# EAGLE design bms (EAGLE 5.06)
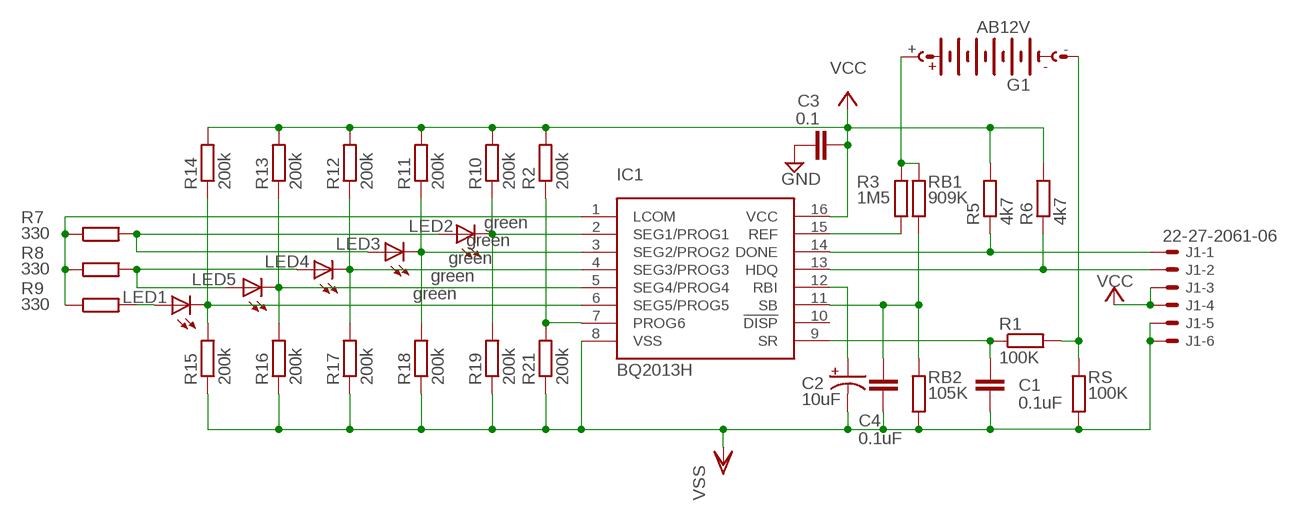
[diagram p0: schematic, sheet 1]

## Parts
C1  0.1uF  C-EU025-024X044  [C025-024X044]
C2  10uF  CPOL-USE1.8-4  [E1,8-4]
C3  0.1  C-EU025-024X044  [C025-024X044]
C4  0.1uF  C-EU025-024X044  [C025-024X044]
G1  AB12V  AB9V  [AB9V]
IC1  BQ2013H  [SO-16]
J1  22-27-2061-06  [6410-06]
LED1  green  LED5MM  [LED5MM]
LED2  green  LED5MM  [LED5MM]
LED3  green  LED5MM  [LED5MM]
LED4  green  LED5MM  [LED5MM]
LED5  green  LED5MM  [LED5MM]
R1  100K  R-EU_0204/7  [0204/7]
R2  200k  R-EU_0204/7  [0204/7]
R3  1M5  R-EU_0204/7  [0204/7]
R5  4k7  R-EU_0204/7  [0204/7]
R6  4k7  R-EU_0204/7  [0204/7]
R7  330  R-EU_0204/7  [0204/7]
R8  330  R-EU_0204/7  [0204/7]
R9  330  R-EU_0204/7  [0204/7]
R10  200k  R-EU_0204/7  [0204/7]
R11  200k  R-EU_0204/7  [0204/7]
R12  200k  R-EU_0204/7  [0204/7]
R13  200k  R-EU_0204/7  [0204/7]
R14  200k  R-EU_0204/7  [0204/7]
R15  200k  R-EU_0204/7  [0204/7]
R16  200k  R-EU_0204/7  [0204/7]
R17  200k  R-EU_0204/7  [0204/7]
R18  200k  R-EU_0204/7  [0204/7]
R19  200k  R-EU_0204/7  [0204/7]
R21  200k  R-EU_0204/7  [0204/7]
RB1  909K  R-EU_0204/7  [0204/7]
RB2  105K  R-EU_0204/7  [0204/7]
RS  100K  R-EU_0204/7  [0204/7]

## Nets
GND: C3.2
N$1: IC1.15(REF) R3.1
N$2: G1.+ R3.2 RB1.2
N$3: C4.1 IC1.11(SB) RB1.1 RB2.2
N$4: G1.- R1.2 RS.2
N$5: IC1.13(HDQ) J1.2 R6.1
N$6: IC1.3(SEG2/PROG2) LED3.K(C) R11.1 R18.2
N$7: IC1.14(DONE) J1.1 R5.1
N$8: IC1.2(SEG1/PROG1) LED2.K(C) R10.1 R19.2
N$9: C2.+ IC1.12(RBI)
N$10: IC1.4(SEG3/PROG3) LED4.K(C) R12.1 R17.2
N$11: IC1.5(SEG4/PROG4) LED5.K(C) R13.1 R16.2
N$12: IC1.6(SEG5/PROG5) LED1.K(C) R14.1 R15.2
N$13: LED2.A LED3.A R7.2
N$14: IC1.7(PROG6) R2.1 R21.2
N$15: LED4.A LED5.A R8.2
N$16: LED1.A R9.2
N$17: IC1.1(LCOM) R7.1 R8.1 R9.1
N$18: C1.1 IC1.9(SR) R1.1
VCC: C3.1 IC1.16(VCC) J1.3 J1.4 R2.2 R5.2 R6.2 R10.2 R11.2 R12.2 R13.2 R14.2
VSS: C1.2 C2.- C4.2 IC1.8(VSS) J1.5 J1.6 R15.1 R16.1 R17.1 R18.1 R19.1 R21.1 RB2.1 RS.1
Unconnected: IC1.10(!DISP)

## Library data of the parts
C1 = resistor:C-EU: CAPACITOR, European symbol
C2 = resistor:CPOL-US: POLARIZED CAPACITOR, American symbol
C3 C4 = rcl:C-EU: CAPACITOR, European symbol
G1 = battery:AB9V: 9-V BATTERY CLIP
IC1 = Gas Gauges:BQ2013H: NiCd/NiMH/Lead-Acid Gas Gauge For High Discharge Rates (>10A), Pgmable Offset Error & Load Comp.
J1 = con-molex:22-?-06: CONNECTOR wire to board 2.54 mm (.1 inch) pitch header
LED1-LED5 = led:LED: LED OSRAM: - CHIPLED LG R971, LG N971, LY N971, LG Q971, LY Q971, LO R971, LY R971 LH N974, LH R974 LS Q976, LO Q976, LY Q976 LO Q996 - Hyper CHIPLED LW Q18S LB Q993, LB Q99A, LB R99A - SideLED LS A670, LO A670, LY A670, LG A670, LP A670 LB A673, LV A673, LT A673, LW A673 LH A674 LY A675 LS A676, LA A676, LO A676, LY A676, LW A676 LS A679, LY A679, LG A679 - Hyper Micro SIDELED® LS Y876, LA Y876, LO Y876, LY Y876 LT Y87S - SmartLED LW L88C, LW L88S LB L89C, LB L89S, LG L890 LS L89K, LO L89K, LY L89K LS L896, LA L896, LO L896, LY L896 - TOPLED LS T670, LO T670, LY T670, LG T670, LP T670 LSG T670, LSP T670, LSY T670, LOP T670, LYG T670 LG T671, LOG T671, LSG T671 LB T673, LV T673, LT T673, LW T673 LH T674 LS T676, LA T676, LO T676, LY T676, LB T676, LH T676, LSB T676, LW T676 LB T67C, LV T67C, LT T67C, LS T67K, LO T67K, LY T67K, LW E67C LS E67B, LA E67B, LO E67B, LY E67B, LB E67C, LV E67C, LT E67C LW T67C LS T679, LY T679, LG T679 LS T770, LO T770, LY T770, LG T770, LP T770 LB T773, LV T773, LT T773, LW T773 LH T774 LS E675, LA E675, LY E675, LS T675 LS T776, LA T776, LO T776, LY T776, LB T776 LHGB T686 LT T68C, LB T68C - Hyper Mini TOPLED® LB M676 - Mini TOPLED Santana® LG M470 LS M47K, LO M47K, LY M47K Source: http://www.osram.convergy.de LUXEON: - LUMILED® LXK2-PW12-R00, LXK2-PW12-S00, LXK2-PW14-U00, LXK2-PW14-V00 LXK2-PM12-R00, LXK2-PM12-S00, LXK2-PM14-U00 LXK2-PE12-Q00, LXK2-PE12-R00, LXK2-PE12-S00, LXK2-PE14-T00, LXK2-PE14-U00 LXK2-PB12-K00, LXK2-PB12-L00, LXK2-PB12-M00, LXK2-PB14-N00, LXK2-PB14-P00, LXK2-PB14-Q00 LXK2-PR12-L00, LXK2-PR12-M00, LXK2-PR14-Q00, LXK2-PR14-R00 LXK2-PD12-Q00, LXK2-PD12-R00, LXK2-PD12-S00 LXK2-PH12-R00, LXK2-PH12-S00 LXK2-PL12-P00, LXK2-PL12-Q00, LXK2-PL12-R00 Source: www.luxeon.com KINGBRIGHT: KA-3528ASYC Source: www.kingbright.com
R1-R3 R5-R19 R21 RB1 RB2 RS = rcl:R-EU_: RESISTOR, European symbol

## Board
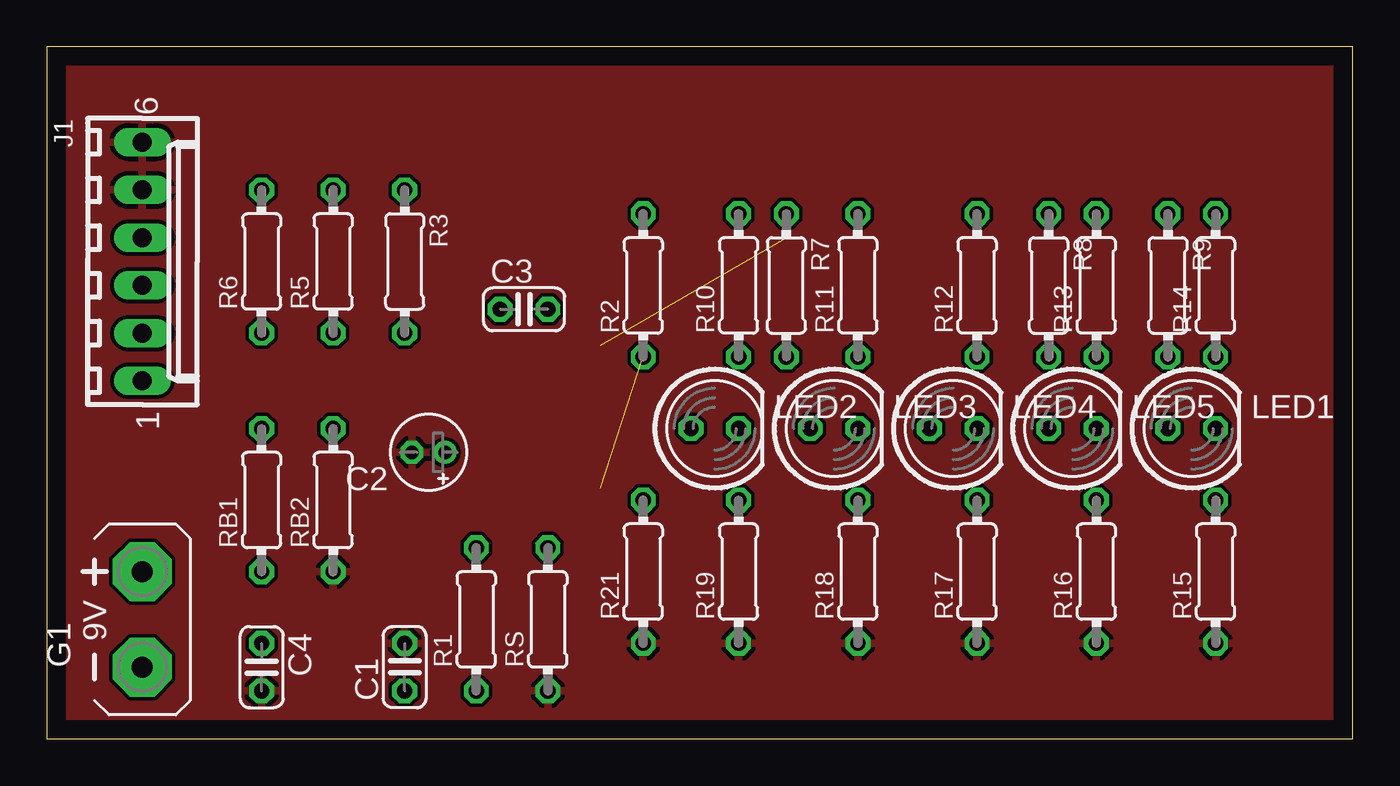
[diagram p1: board, top side]
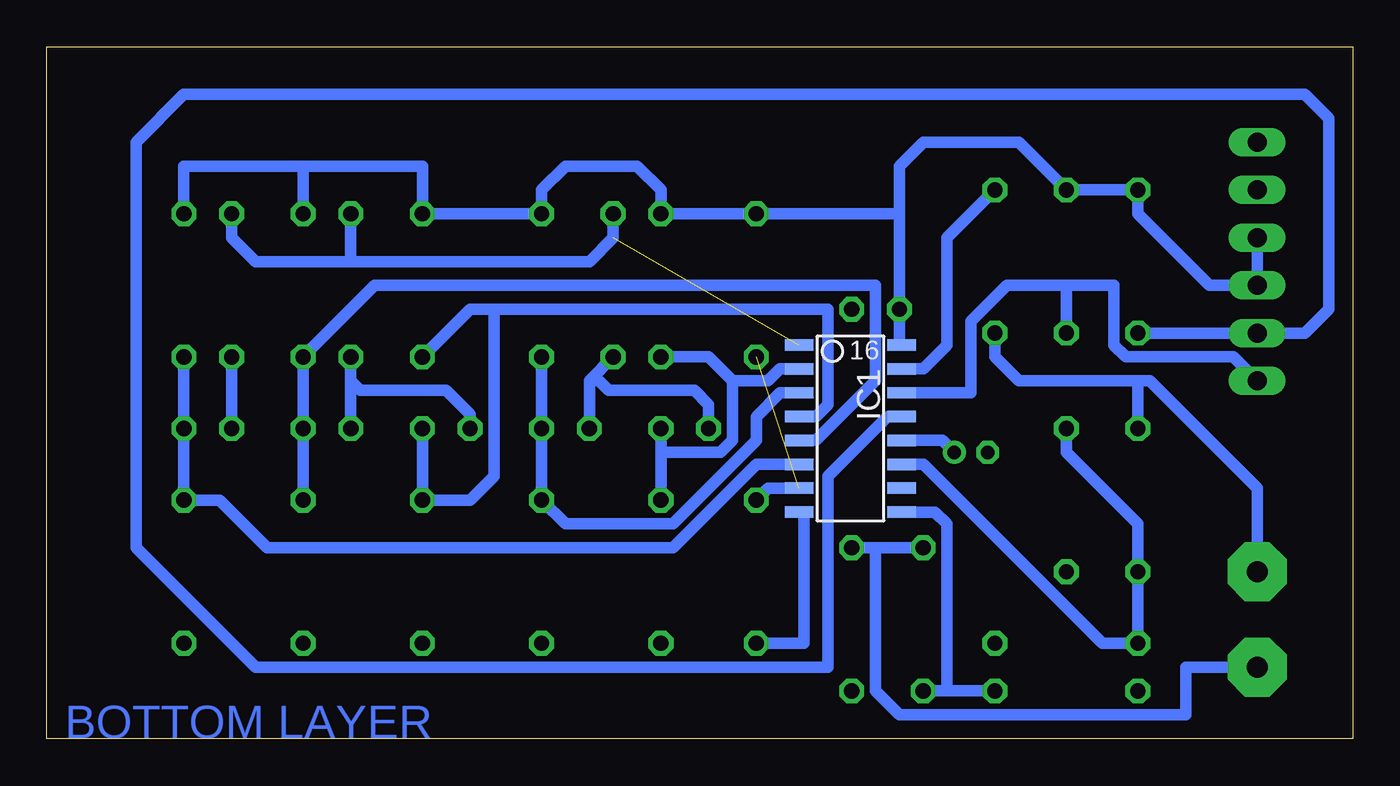
[diagram p2: board, bottom side, seen from below]

Size 69.52 x 36.82 mm. Coordinates in mm from the lower left corner, seen from the top.
Outline: 0,0 69.52,0 69.52,36.82 0,36.82 0,0
Copper layers (1*16): Top 0.035mm / dielectric 1.5mm / Bottom 0.035mm
Design rules "default *": minimum track width 24mil, minimum drill 24mil, track to track 8mil, track to pad 8mil, pad to pad 8mil, via to via 8mil, smd to smd 8mil, copper to edge 40mil, drill to drill 8mil, minimum pad ring 10mil, minimum via ring 8mil, stop-mask expansion 4mil, vias tented up to drill 0mil, thermal gap 10mil

### Footprints (pad centres in the part's own frame; a part is rotated, then mirrored left to right if it is on the bottom)
C025-024X044 = drill 0.813 octagon: 1 -1.27,0; 2 1.27,0
E1,8-4 = drill 0.711 pad 1.168 round: + -0.889,0 | drill 0.711 pad 1.168 octagon: - 0.889,0
AB9V = drill 1.118 pad 3.15 octagon: + 0,2.54; - 0,-2.54
SO-16 = smd 0.61 x 1.524: 1 -4.445,-2.794; 2 -3.175,-2.794; 3 -1.905,-2.794; 4 -0.635,-2.794; 5 0.635,-2.794; 6 1.905,-2.794; 7 3.175,-2.794; 8 4.445,-2.794; 9 4.445,2.667; 10 3.175,2.667; 11 1.905,2.667; 12 0.635,2.667; 13 -0.635,2.667; 14 -1.905,2.667; 15 -3.175,2.667; 16 -4.445,2.667
6410-06 = drill 1.016 long: 1 6.35,0; 2 3.81,0; 3 1.27,0; 4 -1.27,0; 5 -3.81,0; 6 -6.35,0
LED5MM = drill 0.813 octagon: A -1.27,0; K 1.27,0
0204/7 = drill 0.813 octagon: 1 -3.81,0; 2 3.81,0

### Placement (x,y rotation side)
C1  19.05,3.81 90 top
C2  20.32,15.24 180 top
C3  25.4,22.86 0 top
C4  11.43,3.81 270 top
G1  5.08,6.35 0 top
IC1  26.67,16.51 270 bottom
J1  5.08,25.4 270 top
LED1  60.96,16.51 0 top
LED2  35.56,16.51 0 top
LED3  41.91,16.51 0 top
LED4  48.26,16.51 0 top
LED5  54.61,16.51 0 top
R1  22.86,6.35 90 top
R2  31.75,24.13 90 top
R3  19.05,25.4 270 top
R5  15.24,25.4 90 top
R6  11.43,25.4 90 top
R7  39.37,24.13 270 top
R8  53.34,24.13 270 top
R9  59.69,24.13 270 top
R10  36.83,24.13 90 top
R11  43.18,24.13 90 top
R12  49.53,24.13 90 top
R13  55.88,24.13 90 top
R14  62.23,24.13 90 top
R15  62.23,8.89 90 top
R16  55.88,8.89 90 top
R17  49.53,8.89 90 top
R18  43.18,8.89 90 top
R19  36.83,8.89 90 top
R21  31.75,8.89 90 top
RB1  11.43,12.7 90 top
RB2  15.24,12.7 90 top
RS  26.67,6.35 90 top

### Tracks (layer width: path | path; a pad name or v marks a point on that pad's centre or on a via)
N$1
  Bottom 0.61: IC1.15 22.86,19.68 21.59,20.95 21.59,26.67 R3.1
N$2
  Bottom 0.61: 11.43,19.05 10.79,19.05 5.08,13.34 G1.+ | 11.43,19.05 RB1.2 | 11.43,19.05 17.78,19.05 19.05,20.32 R3.2
N$3
  Bottom 0.61: IC1.11 22.86,14.6 13.34,5.08 C4.1 RB1.1 11.43,11.43 15.24,15.24 RB2.2
N$4
  Bottom 0.61: 25.4,10.16 R1.2 | 25.4,10.16 RS.2 | G1.- 8.89,3.81 8.89,1.27 24.13,1.27 25.4,2.54 25.4,10.16
N$5
  Bottom 0.61: IC1.13 24.76,17.14 27.94,13.97 27.94,3.81 58.42,3.81 64.77,10.16 64.77,31.75 62.23,34.29 2.54,34.29 1.27,33.02 1.27,22.86 2.54,21.59 J1.2 R6.1
N$6
  Bottom 0.61: R11.1 LED3.K R18.2 41.91,11.43 36.19,11.43 31.75,15.88 31.75,17.14 30.48,18.41 IC1.3
N$7
  Bottom 0.61: IC1.14 20.32,18.41 20.32,22.23 18.41,24.13 15.24,24.13 | J1.1 6.35,20.32 12.07,20.32 12.7,20.95 12.7,24.13 15.24,24.13 | 15.24,24.13 R5.1
N$8
  Bottom 0.61: 36.83,15.24 LED2.K | R19.2 36.83,15.24 | 33.02,19.05 31.11,19.05 30.48,19.68 IC1.2 | 36.83,15.24 33.66,15.24 33.02,15.88 33.02,19.05 | R10.1 34.29,20.32 33.02,19.05
N$9
  Bottom 0.61: IC1.12 21.84,15.88 C2.+
N$10
  Bottom 0.61: 45.72,22.86 46.99,22.86 R12.1 | 45.72,22.86 27.94,22.86 27.94,17.78 28.57,17.14 IC1.4 | LED4.K R17.2 46.99,12.7 45.72,13.97 45.72,22.86
N$11
  Bottom 0.61: R16.2 LED5.K R13.1 52.07,24.13 25.4,24.13 25.4,19.05 28.57,15.88 IC1.5
N$12
  Bottom 0.61: R14.1 LED1.K R15.2 60.33,12.7 57.78,10.16 36.19,10.16 31.75,14.6 IC1.6
N$13
  Bottom 0.61: LED2.A 34.29,17.78 35.05,18.54 39.62,18.54 40.13,19.05 40.64,19.05 | LED3.A 40.64,19.05 | 40.64,19.05 R7.2
N$14  (1 unrouted)
  Bottom 0.61: IC1.7 31.11,13.34 R21.2
N$15
  Bottom 0.61: LED4.A 46.99,17.27 48.26,18.54 52.83,18.54 53.34,19.05 53.34,19.56 | 53.34,19.56 R8.2 | 53.34,19.56 LED5.A
N$16
  Bottom 0.61: LED1.A R9.2
N$17  (1 unrouted)
  Bottom 0.61: 53.34,25.4 58.42,25.4 59.69,26.67 R9.1 | R7.1 39.37,26.67 40.64,25.4 53.34,25.4 | R8.1 53.34,25.4
N$18
  Bottom 0.61: 21.59,2.54 R1.1 | C1.1 21.59,2.54 | IC1.9 22.22,12.06 21.59,11.43 21.59,2.54
VCC
  Bottom 0.61: J1.4 J1.3 7.62,24.13 11.43,27.94 R6.2 R5.2 17.78,31.75 22.86,31.75 24.13,30.48 24.13,27.94 | IC1.16 24.13,20.95 C3.1 24.13,27.94 | 24.13,27.94 R2.2 R10.2 36.83,29.21 38.1,30.48 41.91,30.48 43.18,29.21 R11.2 R12.2 49.53,30.48 55.88,30.48 | R13.2 55.88,30.48 | 55.88,30.48 62.23,30.48 R14.2
VSS
  Bottom 0.61: R21.1 29.21,5.08 29.21,12.06 IC1.8
  pour Top: 0,36.83 69.85,36.83 69.85,0 0,0

### Text on the board
Bottom: BOTTOM LAYER